# EAGLE schematic skyshieldv0.1 (EAGLE 7.2.0)
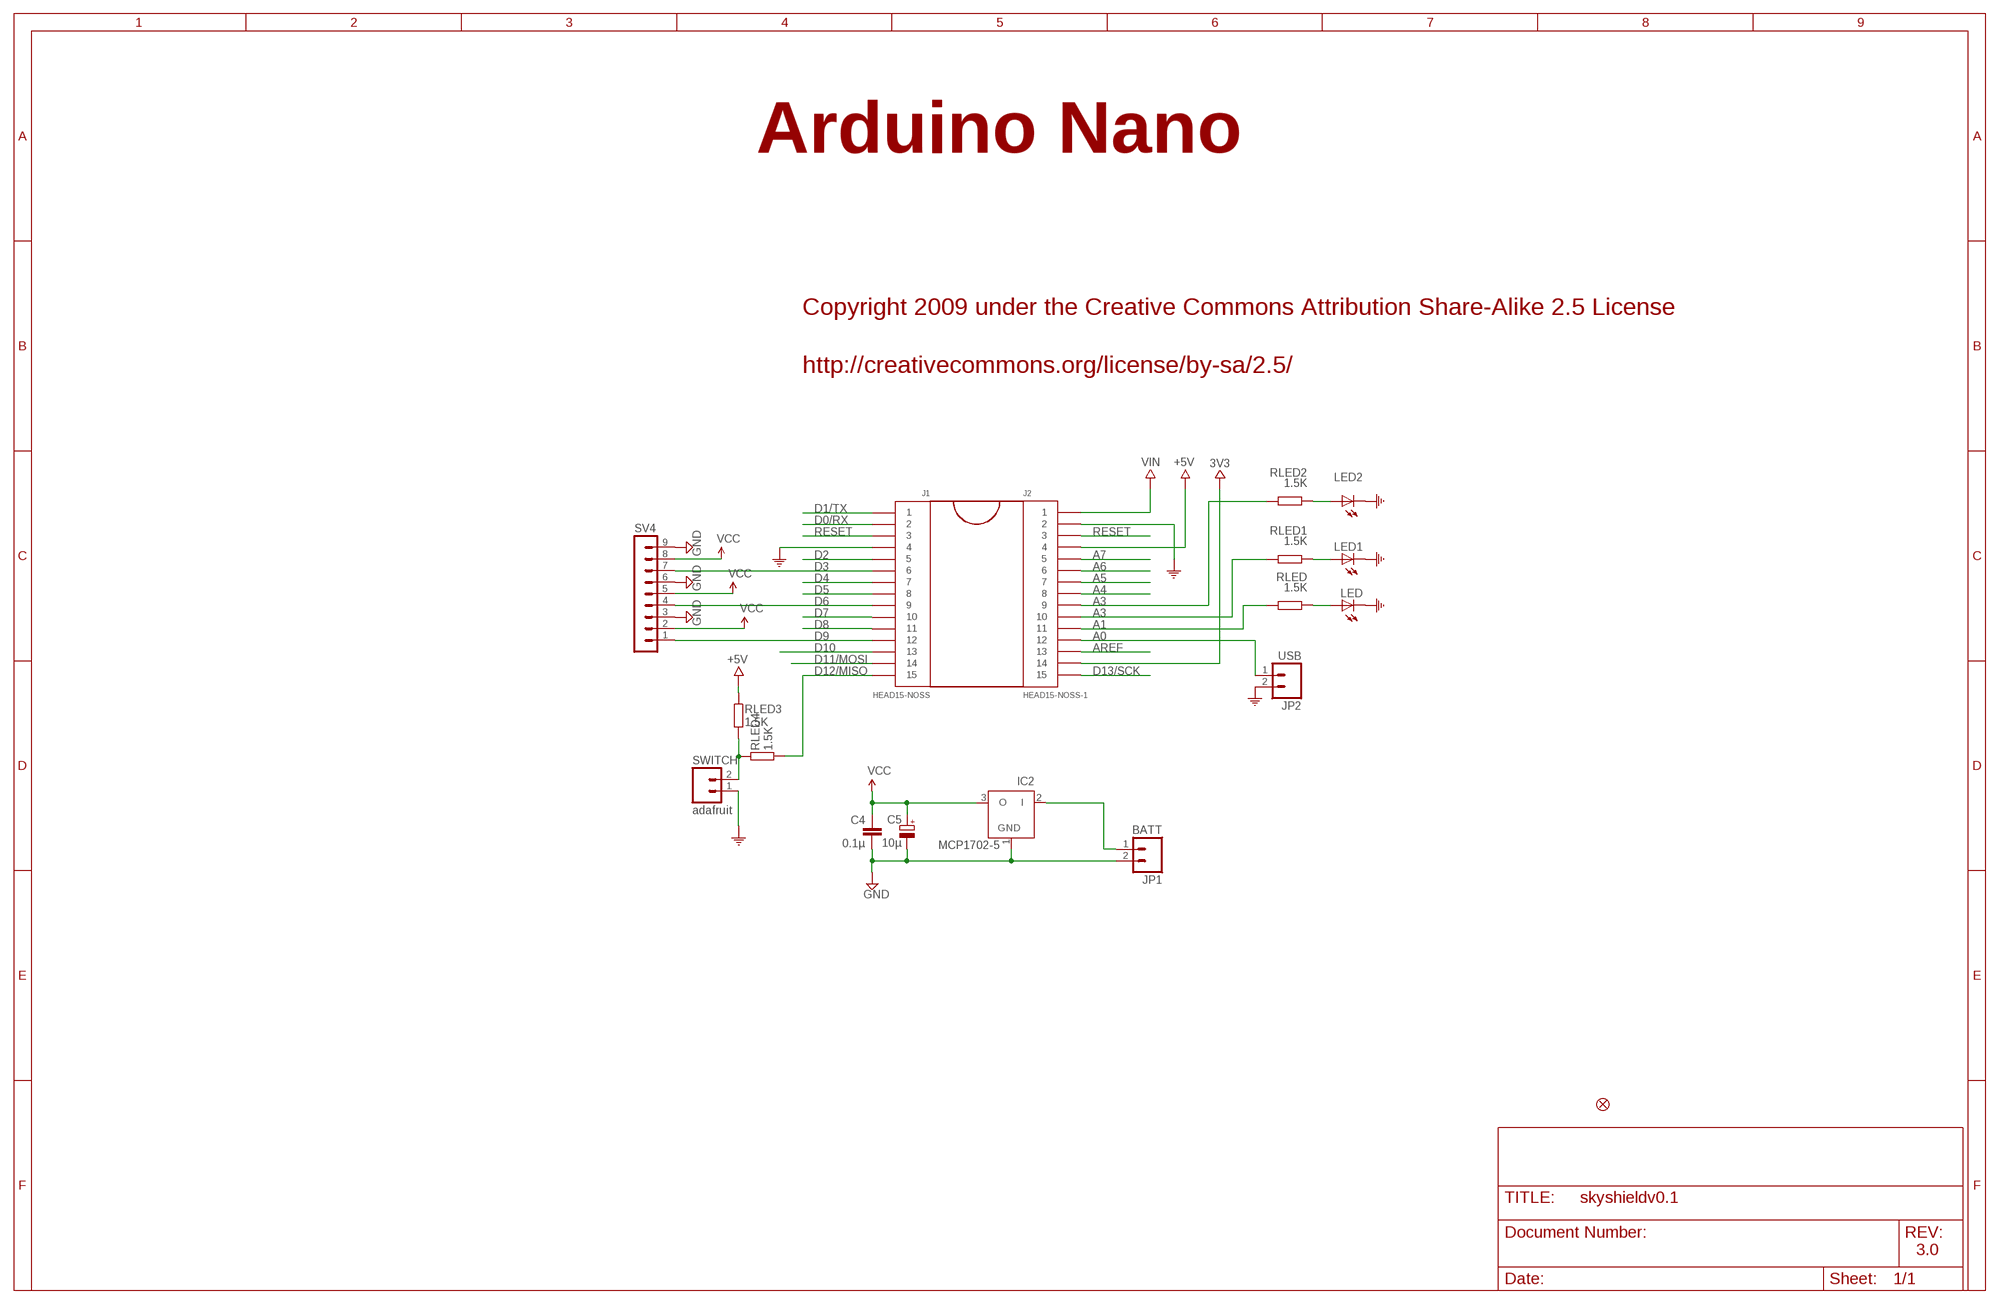
[diagram p0: schematic, sheet 1]

## Parts
C4  0.1µ  C-EU025-024X044  [C025-024X044]
C5  10µ  CPOL-EUE1.8-4  [E1,8-4]
IC2  MCP1702-5  MCP1702Z  [TO92]
J1  HEAD15-NOSS  [HEAD15-NOSS]
J2  HEAD15-NOSS-1  [HEAD15-NOSS-1]
JP1  BATT  M02LOCK_LONGPADS  [1X02_LOCK_LONGPADS]
JP2  USB  M02LOCK_LONGPADS  [1X02_LOCK_LONGPADS]
LED  POWERLED  LED3MM  [LED3MM]
LED1  POWERLED  LED3MM  [LED3MM]
LED2  POWERLED  LED3MM  [LED3MM]
RLED  1.5K  R-EU_0204/7  [0204/7]
RLED1  1.5K  R-EU_0204/7  [0204/7]
RLED2  1.5K  R-EU_0204/7  [0204/7]
RLED3  1.5K  R-EU_0204/7  [0204/7]
RLED4  1.5K  R-EU_0204/7  [0204/7]
SV4  MA09-1  [MA09-1]
SWITCH  adafruit  M02LOCK_LONGPADS  [1X02_LOCK_LONGPADS]
U$54  FIDUCIAL1X2  [FIDUCIAL-1X2]

## Nets
3V3: J2.14
+5V: J2.4 RLED3.1
A0: J2.11 RLED.1
A1: J2.10 RLED1.1
A3: J2.9 RLED2.1
A4: J2.8
A5: J2.7
A6: J2.6
A7: J2.5
AREF: J2.13
COM: J1.4 J2.2 JP2.2 LED1.K(C) LED2.K(C) LED.K(C) SWITCH.1
D0/RX: J1.2
D1/TX: J1.1
D2: J1.5
D3: J1.6 SV4.7
D4: J1.7
D5: J1.8
D6: J1.9 SV4.4
D7: J1.10
D8: J1.11
D9: J1.12 SV4.1
D10: J1.13
D11/MOSI: J1.14
D12/MISO: J1.15 RLED4.2
D13/SCK: J2.15
GND [power]: C4.2 C5.- IC2.1(GND) JP1.2 SV4.3 SV4.6 SV4.9
N$1: LED2.A RLED2.2
N$2: LED1.A RLED1.2
N$3: LED.A RLED.2
N$4: RLED3.2 RLED4.1 SWITCH.2
N$5: J2.12 JP2.1
PWR [power]: IC2.2(I) JP1.1
RESET: J1.3 J2.3
VCC [power]: C4.1 C5.+ IC2.3(O) SV4.2 SV4.5 SV4.8
VIN: J2.1

## Notes on the sheet
- Arduino Nano
- Copyright 2009 under the Creative Commons Attribution Share-Alike 2.5 License
- http://creativecommons.org/license/by-sa/2.5/
- 3.0

## Library data of the parts
C4 = resistor:C-EU: CAPACITOR, European symbol
C5 = resistor:CPOL-EU: POLARIZED CAPACITOR, European symbol
IC2 = JeeLabs:MCP1702: 200 mA, Low Power Low Dropout Voltage Regulator
J1 = MyCON2:HEAD15-NOSS
J2 = MyCON2:HEAD15-NOSS-1
JP1 JP2 SWITCH = SparkFun:M02: Header 2 Standard 2-pin 0.1" header. Use with straight break away headers (SKU : PRT-00116), right angle break away headers (PRT-00553), swiss pins (PRT-00743), machine pins (PRT-00117), and female headers (PRT-00115). Molex polarized connector foot print use with SKU : PRT-08233 with associated crimp pins and housings.
LED LED1 LED2 = adafruit:LED: LED OSRAM: - CHIPLED LG R971, LG N971, LY N971, LG Q971, LY Q971, LO R971, LY R971 LH N974, LH R974 LS Q976, LO Q976, LY Q976 LO Q996 - Hyper CHIPLED LW Q18S LB Q993, LB Q99A, LB R99A - SideLED LS A670, LO A670, LY A670, LG A670, LP A670 LB A673, LV A673, LT A673, LW A673 LH A674 LY A675 LS A676, LA A676, LO A676, LY A676, LW A676 LS A679, LY A679, LG A679 - Hyper Micro SIDELED® LS Y876, LA Y876, LO Y876, LY Y876 LT Y87S - SmartLED LW L88C, LW L88S LB L89C, LB L89S, LG L890 LS L89K, LO L89K, LY L89K LS L896, LA L896, LO L896, LY L896 - TOPLED LS T670, LO T670, LY T670, LG T670, LP T670 LSG T670, LSP T670, LSY T670, LOP T670, LYG T670 LG T671, LOG T671, LSG T671 LB T673, LV T673, LT T673, LW T673 LH T674 LS T676, LA T676, LO T676, LY T676, LB T676, LH T676, LSB T676, LW T676 LB T67C, LV T67C, LT T67C, LS T67K, LO T67K, LY T67K, LW E67C LS E67B, LA E67B, LO E67B, LY E67B, LB E67C, LV E67C, LT E67C LW T67C LS T679, LY T679, LG T679 LS T770, LO T770, LY T770, LG T770, LP T770 LB T773, LV T773, LT T773, LW T773 LH T774 LS E675, LA E675, LY E675, LS T675 LS T776, LA T776, LO T776, LY T776, LB T776 LHGB T686 LT T68C, LB T68C - Hyper Mini TOPLED® LB M676 - Mini TOPLED Santana® LG M470 LS M47K, LO M47K, LY M47K Source: http://www.osram.convergy.de/
RLED RLED1-RLED4 = rcl:R-EU_: RESISTOR, European symbol
SV4 = con-lstb:MA09-1: PIN HEADER; OC_FARNELL: unknown; OC_NEWARK: unknown
U$54 = SparkFun:FIDUCIAL: Fiducial Alignment Points Various fiducial points for machine vision alignment.

## Net classes
0 default: width 0.406 mm, clearance 0.203 mm
1 power: width 0.813 mm, clearance 0.203 mm